# EasyEDA Pro project lcd1601转接板工程文件.eprj

# Schematic Schematic1
Create Date: 2024-12-11; Page Name: P1; Project Name: C4主板优化v3.1; Schematic Name: Schematic1; Update Date: 2025-03-25; Company: 嘉立创EDA; Page Size: A4; Version: V1.0
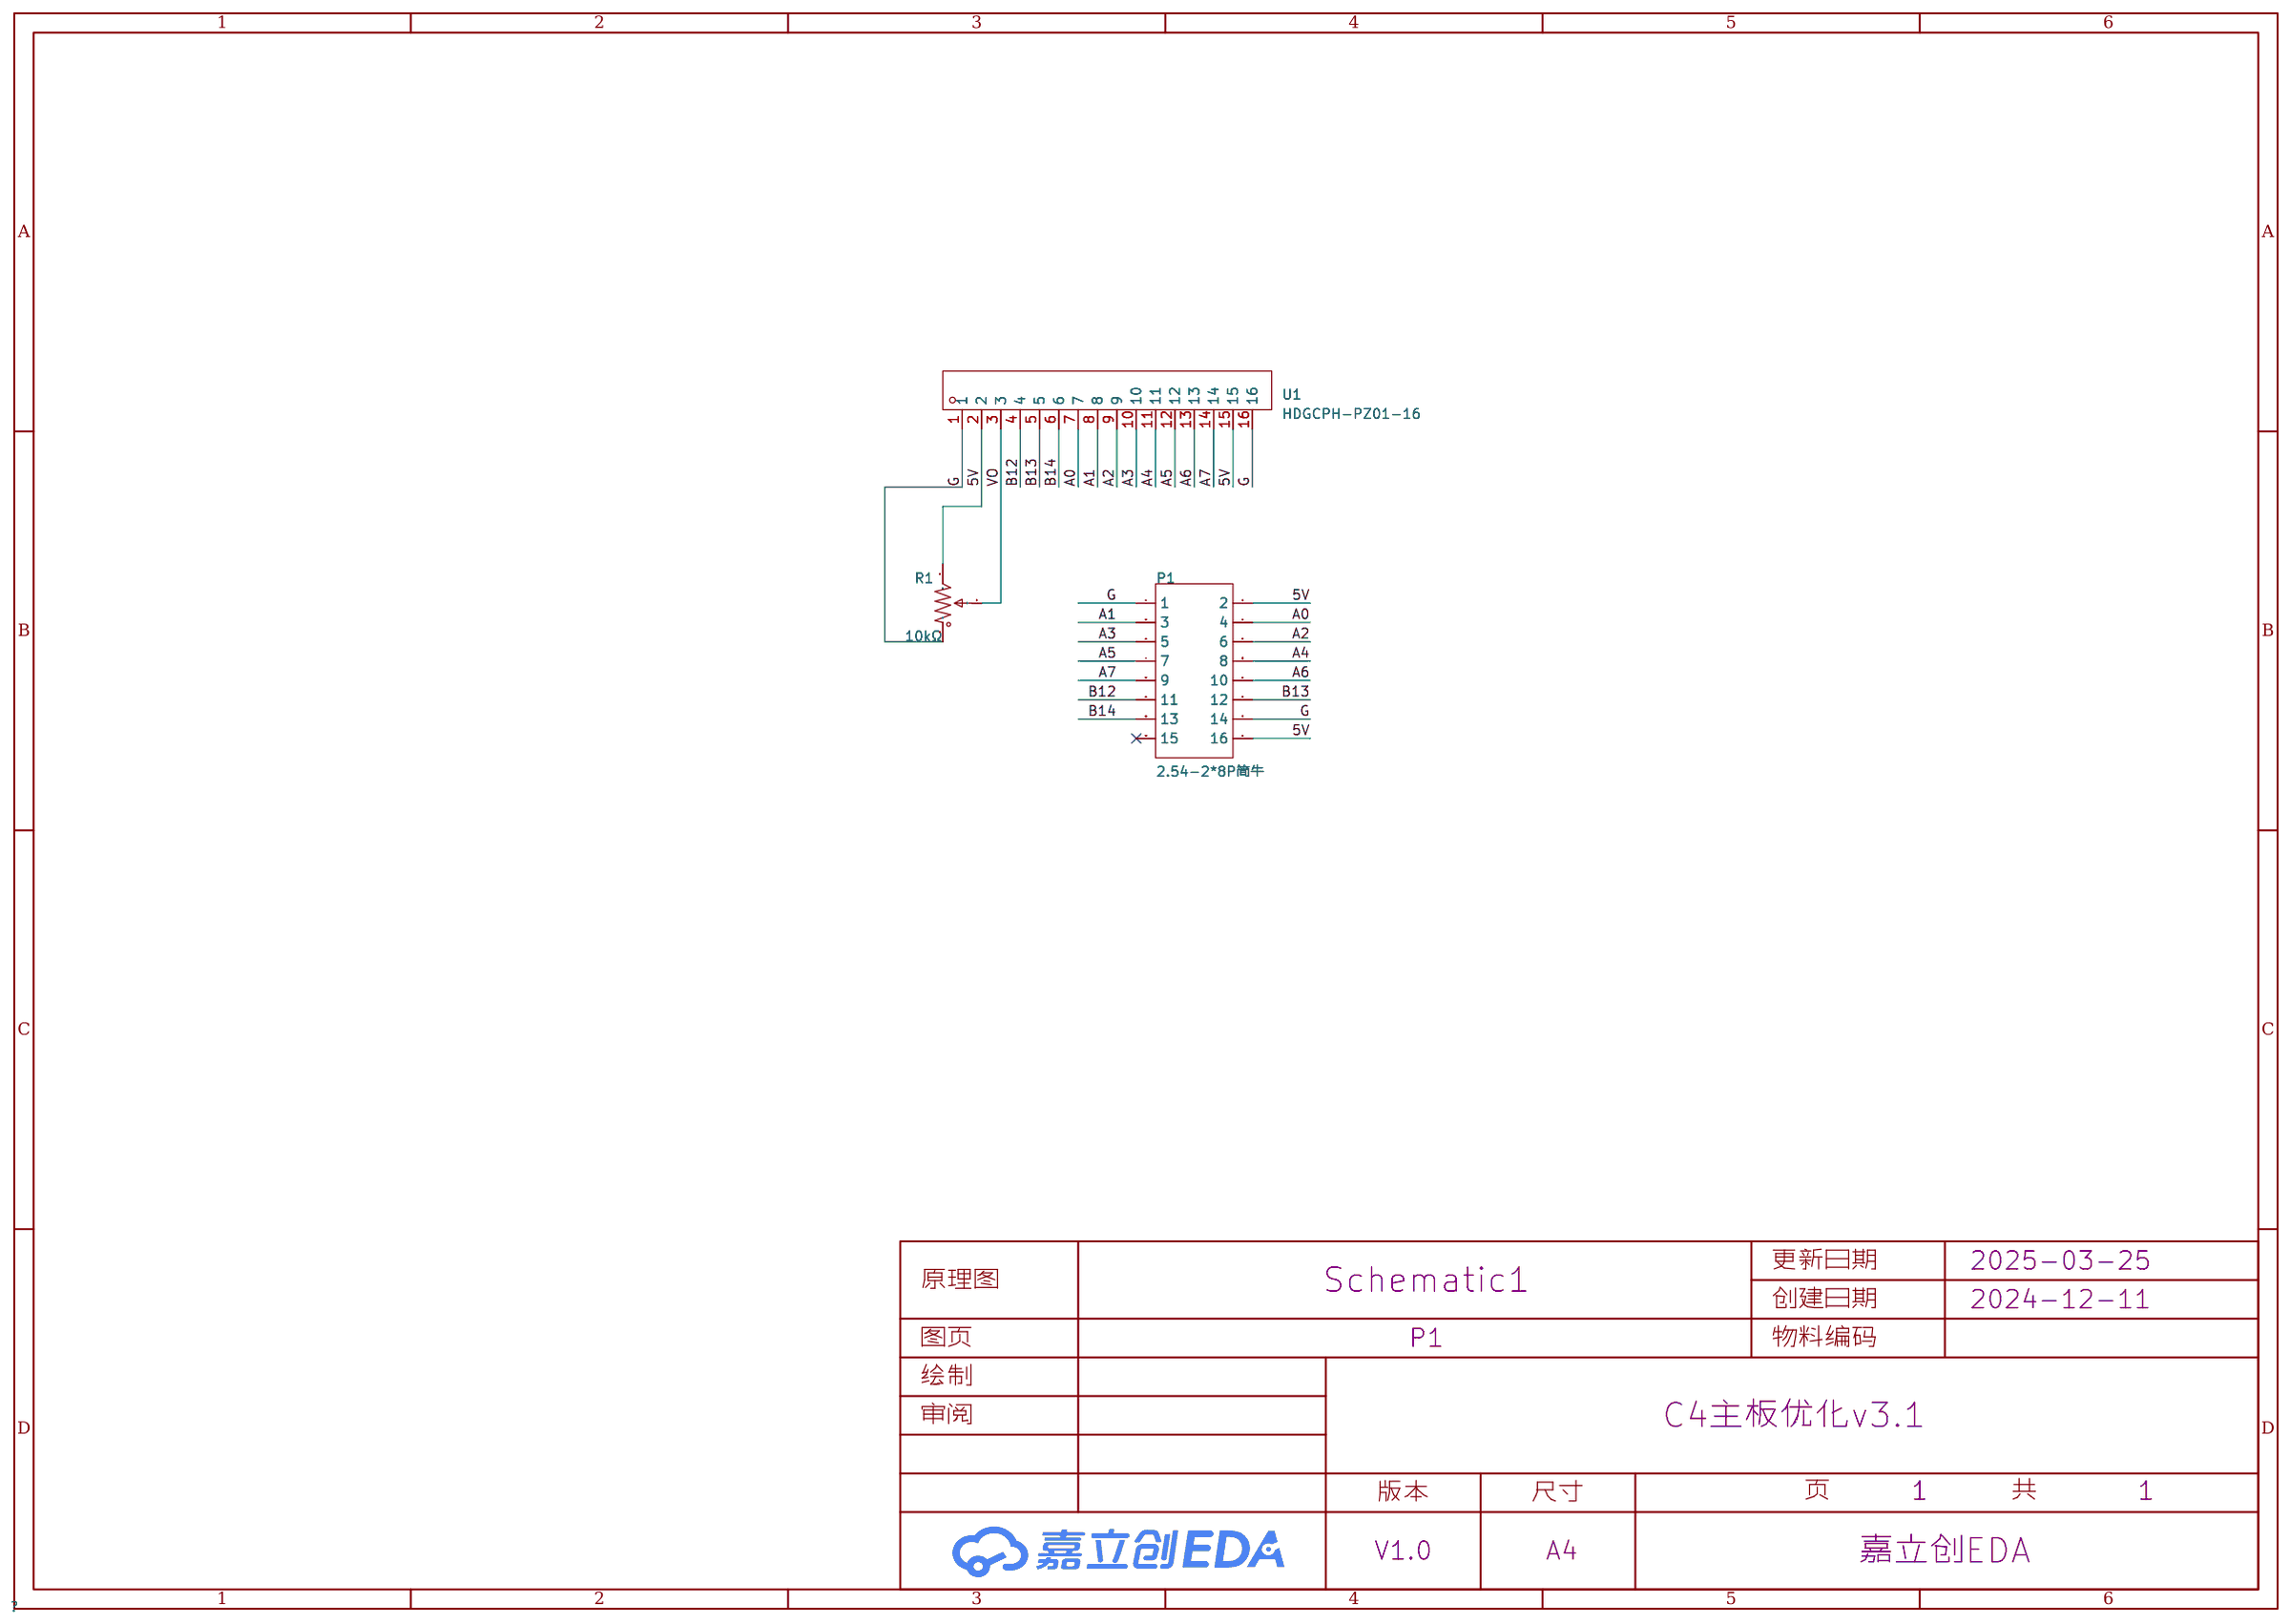
[diagram p0: schematic sheet]

## Parts
P1  2.54-2*8P简牛  [IDC-TH_16P-P2.54_C3406]
R1  10kΩ  [RES-ADJ-TH_3362P]
U1  HDGCPH-PZ01-16  [HDR-TH_16P-P2.54-V-M_1]

## Library data of the parts
P1 = 2.54-2*8P简牛: 连接器类型:简牛座;间距:2.54mm;结构:2x8P;封装形式:直插;行距:2.54mm;排数:2;每排PIN数:8;触头材质:-;触头镀层:-;; LCSC Part Name: 2.54mm 2x8P 排数:2 每排P数:8; Supplier Part: C3406; Manufacturer: BOOMELE(博穆精密); Supplier Footprint: 插件,P=2.54mm; JLCPCB Part Class: 扩展库; Datasheet: https://atta.szlcsc.com/upload/public/pdf/source/20131122/1457706661483.pdf; Supplier: LCSC; Connector Type: 简牛座; Pitch: 2.54mm; Structure: 2x8P; Holder Type: 直插; Row Spacing: 2.54mm; Number of Rows: 2; Pin Number in each Row: 8
R1 = 3362P-1-103: 阻值:10kΩ;精度:±10%;; LCSC Part Name: 10kΩ ±10%; Supplier Part: C118956; Manufacturer: BOCHEN(博晨); Supplier Footprint: 插件; JLCPCB Part Class: 扩展库; Datasheet: https://atta.szlcsc.com/upload/public/pdf/source/20171114/C118956_15106326650691117445.pdf; Supplier: LCSC; Tolerance: ±10%
U1 = HDGCPH-PZ01-16: LCSC Part Name: 2.54单排针直插排针L11.6/3.0 1x16P; Supplier Part: C19190982; Manufacturer: HDGC(华德共创); Supplier Footprint: 插件,P=2.54mm; Datasheet: https://atta.szlcsc.com/upload/public/pdf/source/20231110/9EB16C2E1D607182756B4718BDE6A9C4.pdf; Supplier: LCSC

## Nets
5V: P1.2 P1.16 R1.3 U1.2 U1.15
A0: P1.4 U1.7
A1: P1.3 U1.8
A2: P1.6 U1.9
A3: P1.5 U1.10
A4: P1.8 U1.11
A5: P1.7 U1.12
A6: P1.10 U1.13
A7: P1.9 U1.14
B12: P1.11 U1.4
B13: P1.12 U1.5
B14: P1.13 U1.6
G: P1.1 P1.14 R1.1 U1.1 U1.16
VO: R1.2 U1.3

Not connected (* = marked no-connect by the designer): P1 15*

# Board PCB1_1
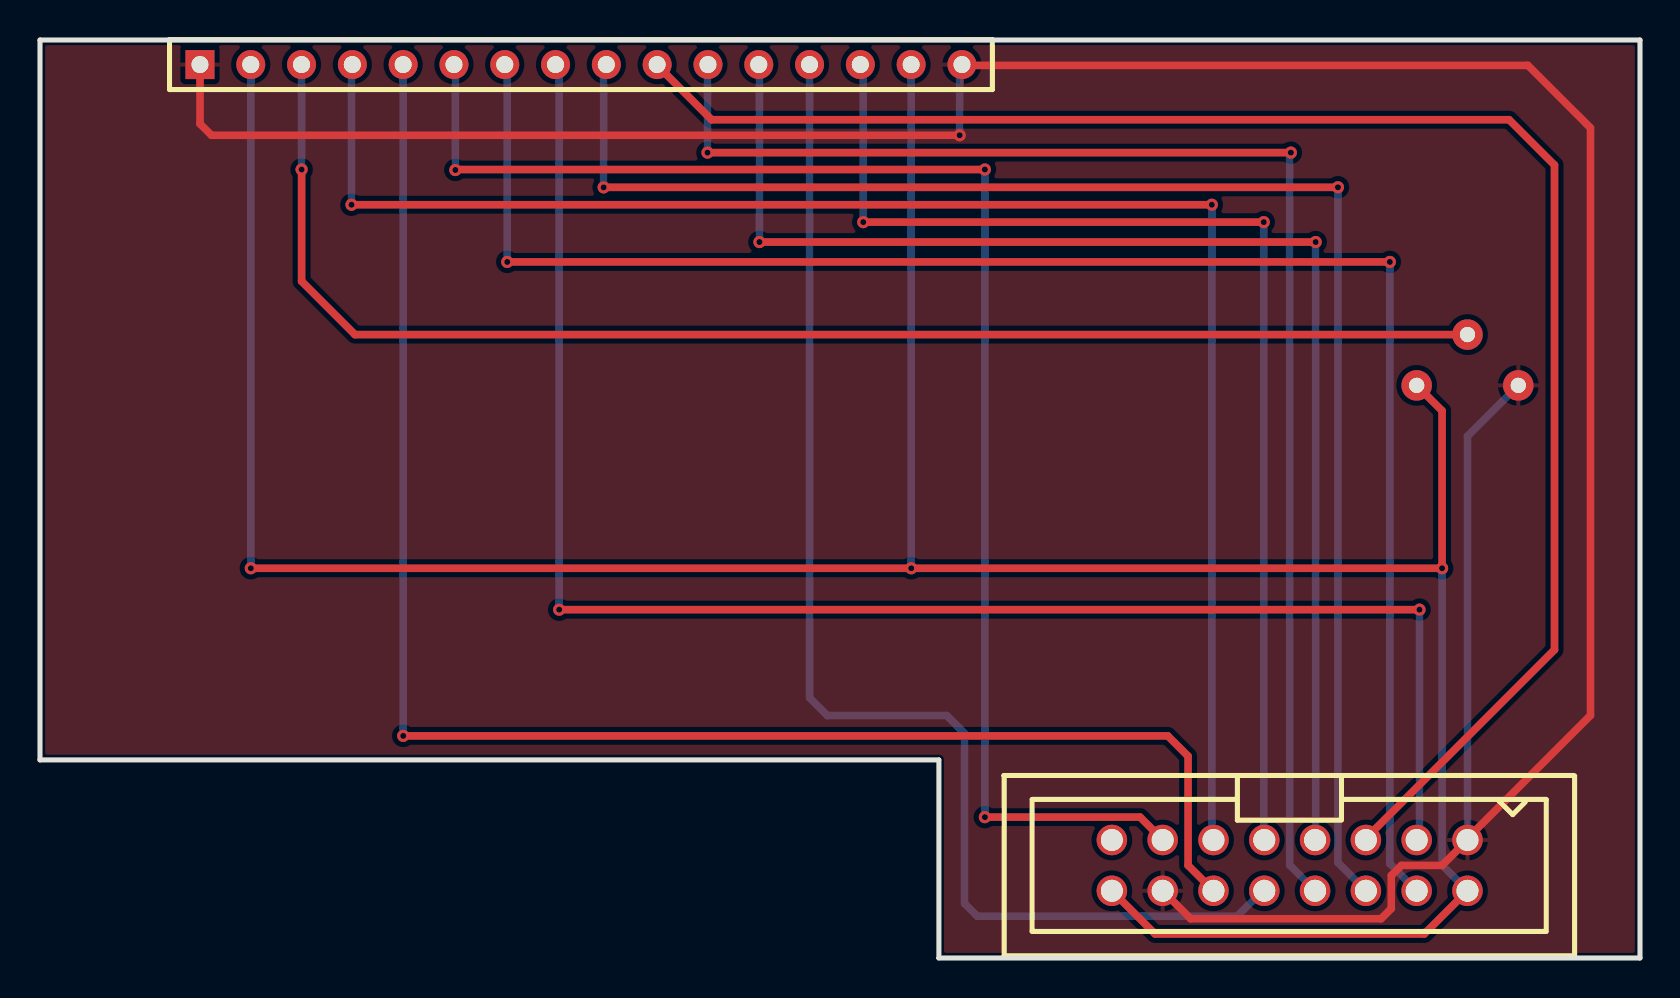
[diagram p1: board, top side]
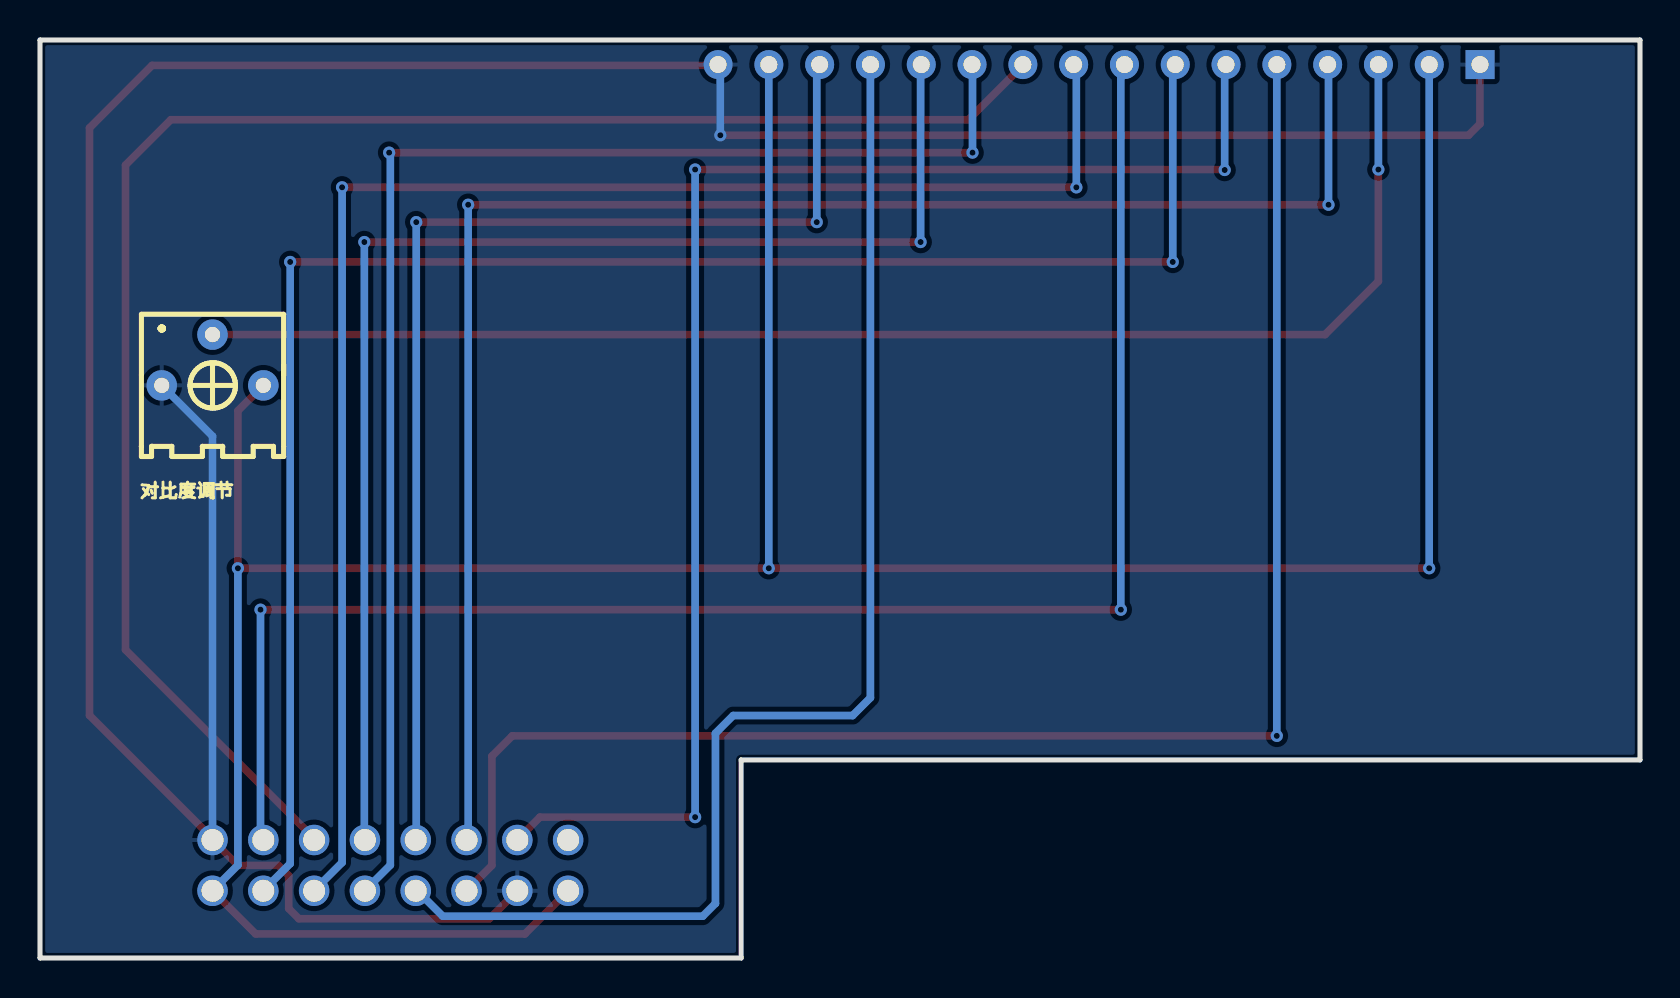
[diagram p2: board, bottom side, seen from below]

Outline 80 x 45.91 mm; copper layers: Top Layer, Bottom Layer. Coordinates in mm from the lower left corner of the outline.
Outline path: 0,45.91 0,9.91 44.94,9.91 44.94,0 80,0 80,45.91 0,45.91
Stack: Top Layer 0.035mm / Dielectric1 1.51mm FR4 er 4.5 / Bottom Layer 0.035mm

## Design rules (mm)
template: JLCPCB Capability(Two Layers Board)
spacing copperThickness1oz (default): track to track 0.102, other pairs 0.152 to 0.3
spacing copperThickness2oz: track to track 0.203, other pairs 0.152 to 0.3
track width copperThickness1oz (default): min 0.127, default 0.254, max 2.54
track width copperThickness2oz: min 0.203, default 0.254, max 2.54
differential pair differentialPair (default): width min 0.127, default 0.254, max 2.54; gap min 0.152, default 0.152
via viaSize (default): diameter min 0.5, default 0.61, max 10; hole min 0.3, default 0.305, max 6.3

## Placement (name value [footprint] x y rotation side)
P1  2.54-2*8P简牛  [IDC-TH_16P-P2.54_C3406]  62.48 4.63 180 top
U1  HDGCPH-PZ01-16  [HDR-TH_16P-P2.54-V-M_1]  27.05 44.68 0 top
对比度调节  10kΩ  [RES-ADJ-TH_3362P]  71.37 29.9 180 bottom

## Footprints (pads in the part's own frame, mm; a bottom-side part is the same pattern mirrored in y, then rotated)
HDR-TH_16P-P2.54-V-M_1
  rect 1.45x1.45 hole 0.85: 1(-19.05,0)
  round 1.45 hole 0.85: 2(-16.51,0) 3(-13.97,0) 4(-11.43,0) 5(-8.89,0) 6(-6.35,0) 7(-3.81,0) 8(-1.27,0) 9(1.27,0) 10(3.81,0) 11(6.35,0) 12(8.89,0) 13(11.43,0) 14(13.97,0) 15(16.51,0) 16(19.05,0)
IDC-TH_16P-P2.54_C3406
  round 1.524 hole 1.1: 1(-8.89,-1.27) 2(-8.89,1.27) 3(-6.35,-1.27) 4(-6.35,1.27) 5(-3.81,-1.27) 6(-3.81,1.27) 7(-1.27,-1.27) 8(-1.27,1.27) 9(1.27,-1.27) 10(1.27,1.27) 11(3.81,-1.27) 12(3.81,1.27) 13(6.35,-1.27) 14(6.35,1.27) 15(8.89,-1.27) 16(8.89,1.27)
RES-ADJ-TH_3362P
  round 1.524 hole 0.762: 1(-2.54,-1.27) 2(0,1.27) 3(2.54,-1.27)

## Nets
5V: P1.2 P1.16 U1.2 U1.15 对比度调节.3
A0: P1.4 U1.7
A1: P1.3 U1.8
A2: P1.6 U1.9
A3: P1.5 U1.10
A4: P1.8 U1.11
A5: P1.7 U1.12
A6: P1.10 U1.13
A7: P1.9 U1.14
B12: P1.11 U1.4
B13: P1.12 U1.5
B14: P1.13 U1.6
G: P1.1 P1.14 U1.1 U1.16 对比度调节.1
VO: U1.3 对比度调节.2

Pads without a net: P1 15

## Via types
v1: diameter 0.61, hole 0.305, Top Layer to Bottom Layer, 23 vias

## Routing (per net, layer and track width the routed paths; a pad name or vN(x,y) marks a point on that pad's centre or on a via; arc(x,y) is an arc through that point)
5V: length 155.7
  Top Layer w0.381: 对比度调节.3 70.1,27.36 v1(70.1,19.49) v1(43.56,19.49) v1(10.54,19.49) ; P1.16 55.75,1.2 69.22,1.2 P1.2
  Bottom Layer w0.381: 71.34,3.41 70.1,4.65 v1(70.1,19.49) ; v1(10.54,19.49) 10.54,44.64 ; v1(43.56,19.49) 43.56,44.64
A0: length 85.9
  Top Layer w0.381: v1(67.49,34.81) v1(23.36,34.81)
  Bottom Layer w0.381: 68.8,3.41 67.49,4.72 v1(67.49,34.81) ; 23.24,44.64 23.36,44.51 v1(23.36,34.81)
A1: length 81.9
  Top Layer w0.381: v1(68.97,17.42) v1(25.96,17.42)
  Bottom Layer w0.381: 68.8,5.95 68.97,6.12 v1(68.97,17.42) ; 25.78,44.64 25.96,44.46 v1(25.96,17.42)
A2: length 78.6
  Top Layer w0.381: v1(64.9,38.54) 28.19,38.54 v1(28.18,38.54)
  Bottom Layer w0.381: 28.32,44.64 28.18,44.5 v1(28.18,38.54) ; v1(64.9,38.54) 64.9,4.77 66.26,3.41
A3: length 84.6
  Top Layer w0.381: 30.86,44.64 33.58,41.92 73.46,41.92 75.72,39.65 75.72,15.41 66.26,5.95
A4: length 70.9
  Top Layer w0.381: v1(62.54,40.27) v1(33.38,40.27)
  Bottom Layer w0.381: 33.4,44.64 33.38,44.61 v1(33.38,40.27) ; v1(62.54,40.27) 62.48,40.21 62.48,4.65 63.72,3.41
A5: length 66.5
  Top Layer w0.381: v1(63.78,35.8) v1(35.97,35.8)
  Bottom Layer w0.381: 35.94,44.64 35.97,44.61 v1(35.97,35.8) ; 63.72,5.95 63.78,6.01 v1(63.78,35.8)
A6: length 64.4
  Bottom Layer w0.381: 61.18,3.41 59.86,2.09 46.86,2.09 46.23,2.73 46.23,11.23 45.34,12.12 39.37,12.12 38.48,13.01 38.48,44.64
A7: length 58.8
  Top Layer w0.381: v1(61.19,36.8) v1(41.16,36.8)
  Bottom Layer w0.381: 61.18,5.95 61.19,5.96 v1(61.19,36.8) ; 41.02,44.64 41.16,44.49 v1(41.16,36.8)
B12: length 81.7
  Top Layer w0.381: v1(15.58,37.67) v1(58.59,37.67)
  Bottom Layer w0.381: v1(15.58,37.67) 15.58,44.59 15.62,44.64 ; v1(58.59,37.67) 58.59,6 58.64,5.95
B13: length 80.4
  Top Layer w0.381: P1.12 57.4,4.63 57.4,10.09 56.39,11.11 v1(18.16,11.11)
  Bottom Layer w0.381: v1(18.16,11.11) 18.16,44.64
B14: length 73.4
  Top Layer w0.381: v1(47.24,7.04) 55,7.04 56.1,5.95 ; v1(20.77,39.4) 20.79,39.43 v1(47.24,39.43)
  Bottom Layer w0.381: v1(20.77,39.4) 20.77,44.57 20.7,44.64 ; v1(47.24,39.43) v1(47.24,7.04)
G: length 157.8
  Top Layer w0.381: U1.1 8,44.67 8,41.72 8.57,41.14 v1(45.98,41.14) ; 46.1,44.64 74.4,44.64 77.52,41.51 77.52,12.13 71.34,5.95 ; 71.37,5.9 70.1,4.63 68.07,4.63 67.56,4.12 67.56,2.47 67.06,1.96 57.53,1.96 P1.14
  Bottom Layer w0.381: 71.37,5.9 71.37,26.09 对比度调节.1 ; v1(45.98,41.14) 45.98,44.52 46.1,44.64
VO: length 70.2
  Top Layer w0.381: 对比度调节.2 15.75,31.17 13.08,33.84 v1(13.08,39.43)
  Bottom Layer w0.381: v1(13.08,39.43) 13.08,44.67 U1.3

## Copper pours and planes (outline as drawn; the poured copper is in the pictures)
G on Top Layer: -1.52,47.68 81.53,47.68 81.53,-1.34 -1.52,-1.34
G on Bottom Layer: -1.52,47.68 81.53,47.68 81.53,-1.34 -1.52,-1.34
